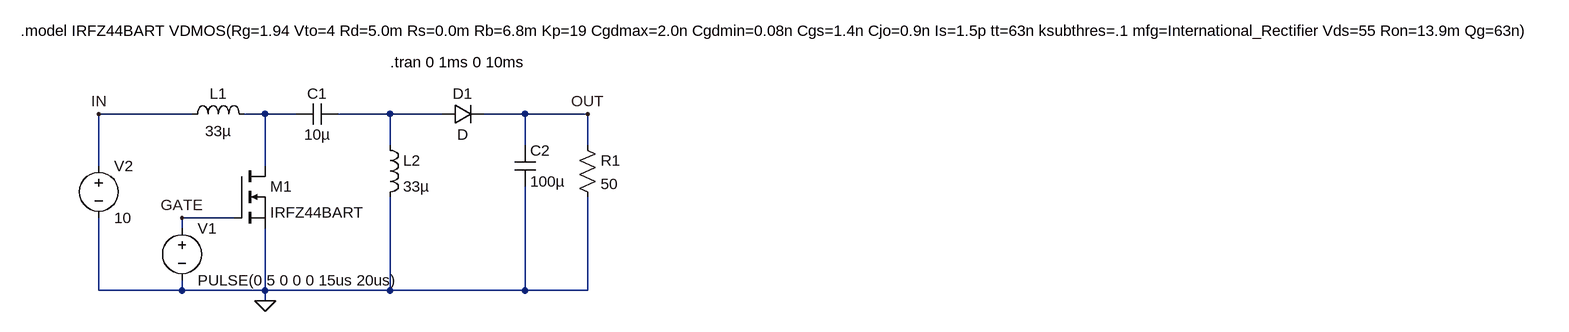
[diagram p0: schematic SEPIC.asc]
SEPIC.asc, the LTspice schematic file:
Version 4
SHEET 1 3504 680
WIRE 128 128 -16 128
WIRE 240 128 208 128
WIRE 288 128 240 128
WIRE 432 128 352 128
WIRE 512 128 432 128
WIRE 640 128 576 128
WIRE 736 128 640 128
WIRE 432 176 432 128
WIRE 640 176 640 128
WIRE 736 176 736 128
WIRE -16 208 -16 128
WIRE 240 208 240 128
WIRE 192 288 112 288
WIRE 112 304 112 288
WIRE -16 400 -16 288
WIRE 112 400 112 384
WIRE 112 400 -16 400
WIRE 240 400 240 304
WIRE 240 400 112 400
WIRE 432 400 432 256
WIRE 432 400 240 400
WIRE 640 400 640 240
WIRE 640 400 432 400
WIRE 736 400 736 256
WIRE 736 400 640 400
WIRE 240 416 240 400
FLAG 240 416 0
FLAG -16 128 IN
FLAG 736 128 OUT
FLAG 112 288 GATE
SYMBOL ind 112 144 R270
WINDOW 0 32 56 VTop 2
WINDOW 3 5 56 VBottom 2
SYMATTR InstName L1
SYMATTR Value 33µ
SYMBOL cap 352 112 R90
WINDOW 0 0 32 VBottom 2
WINDOW 3 32 32 VTop 2
SYMATTR InstName C1
SYMATTR Value 10µ
SYMBOL ind 416 160 R0
SYMATTR InstName L2
SYMATTR Value 33µ
SYMBOL diode 512 144 R270
WINDOW 0 32 32 VTop 2
WINDOW 3 0 32 VBottom 2
SYMATTR InstName D1
SYMBOL cap 624 176 R0
SYMATTR InstName C2
SYMATTR Value 100µ
SYMBOL res 720 160 R0
SYMATTR InstName R1
SYMATTR Value 50
SYMBOL nmos 192 208 R0
SYMATTR InstName M1
SYMATTR Value IRFZ44BART
SYMBOL voltage 112 288 R0
WINDOW 123 0 0 Left 0
WINDOW 39 0 0 Left 0
SYMATTR InstName V1
SYMATTR Value PULSE(0 5 0 0 0 15us 20us)
SYMBOL voltage -16 192 R0
WINDOW 123 0 0 Left 0
WINDOW 39 0 0 Left 0
SYMATTR InstName V2
SYMATTR Value 10
TEXT 432 48 Left 2 !.tran 0 1ms 0 10ms
TEXT -136 0 Left 2 !.model IRFZ44BART VDMOS(Rg=1.94 Vto=4 Rd=5.0m Rs=0.0m Rb=6.8m Kp=19 Cgdmax=2.0n Cgdmin=0.08n Cgs=1.4n Cjo=0.9n Is=1.5p tt=63n ksubthres=.1 mfg=International_Rectifier Vds=55 Ron=13.9m Qg=63n)

The netlist it stands for:
* SEPIC.asc
L1 IN N001 33µ
C1 N002 N001 10µ
L2 N002 0 33µ
D1 N002 OUT D
C2 OUT 0 100µ
R1 OUT 0 50
M1 N001 GATE 0 0 IRFZ44BART
V1 GATE 0 PULSE(0 5 0 0 0 15us 20us)
V2 IN 0 10
.model D D
.lib standard.dio
.model NMOS NMOS
.model PMOS PMOS
.lib standard.mos
.tran 0 1ms 0 10ms
.model IRFZ44BART VDMOS(Rg=1.94 Vto=4 Rd=5.0m Rs=0.0m Rb=6.8m Kp=19 Cgdmax=2.0n Cgdmin=0.08n Cgs=1.4n Cjo=0.9n Is=1.5p tt=63n ksubthres=.1 mfg=International_Rectifier Vds=55 Ron=13.9m Qg=63n)
.backanno
.end

* Results of the author's LTspice run, read from the files saved beside the schematic
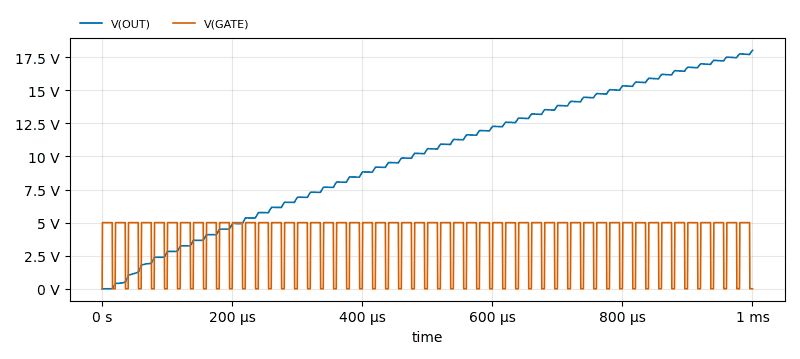
[diagram p1: Transient Analysis of SEPIC.asc, plotted from the saved traces]
* Transient Analysis, 1 run:
*   V(OUT): min 0 V, max 18.02 V, average 9.989 V, rms 11.22 V, last 18.02 V
*   V(GATE): min 0 V, max 5 V, average 3.875 V, rms 4.38 V, last 0 V